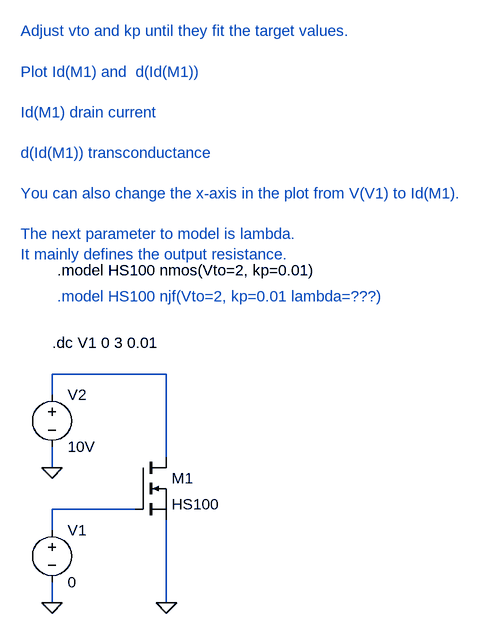
[diagram p0: schematic nmos_model.asc]
nmos_model.asc, the LTspice schematic file:
Version 4
SHEET 1 924 680
WIRE 0 80 0 48
WIRE 0 192 0 160
WIRE 0 288 0 256
WIRE 0 400 0 368
WIRE 128 256 0 256
WIRE 176 48 0 48
WIRE 176 176 176 48
WIRE 176 400 176 272
FLAG 0 400 0
FLAG 176 400 0
FLAG 0 192 0
SYMBOL voltage 0 272 R0
SYMATTR InstName V1
SYMATTR Value 0
SYMBOL voltage 0 64 R0
SYMATTR InstName V2
SYMATTR Value 10V
SYMBOL nmos 128 176 R0
SYMATTR InstName M1
SYMATTR Value HS100
TEXT 0 0 Left 0 !.dc V1 0 3 0.01
TEXT 8 -112 Left 0 !.model HS100 nmos(Vto=2, kp=0.01)
TEXT -48 -480 Left 0 ;Adjust vto and kp until they fit the target values.\n \nPlot Id(M1) and  d(Id(M1))\n \nId(M1) drain current\n \nd(Id(M1)) transconductance\n \nYou can also change the x-axis in the plot from V(V1) to Id(M1).\n \nThe next parameter to model is lambda. \nIt mainly defines the output resistance.
TEXT 8 -72 Left 0 ;.model HS100 njf(Vto=2, kp=0.01 lambda=???)

The netlist it stands for:
* nmos_model.asc
V1 N002 0 0
V2 N001 0 10V
M1 N001 N002 0 0 HS100
.model NMOS NMOS
.model PMOS PMOS
.lib standard.mos
.dc V1 0 3 0.01
.model HS100 nmos(Vto=2, kp=0.01)
* Adjust vto and kp until they fit the target values.
* Plot Id(M1) and  d(Id(M1))
* Id(M1) drain current
* d(Id(M1)) transconductance
* You can also change the x-axis in the plot from V(V1) to Id(M1).
* The next parameter to model is lambda.
* It mainly defines the output resistance.
* .model HS100 njf(Vto=2, kp=0.01 lambda=???)
.backanno
.end